# EAGLE design RS485_V3 (EAGLE 9.6.2)
CNAME: Vikings Robotics; DESIGNER: Ali ElShimy
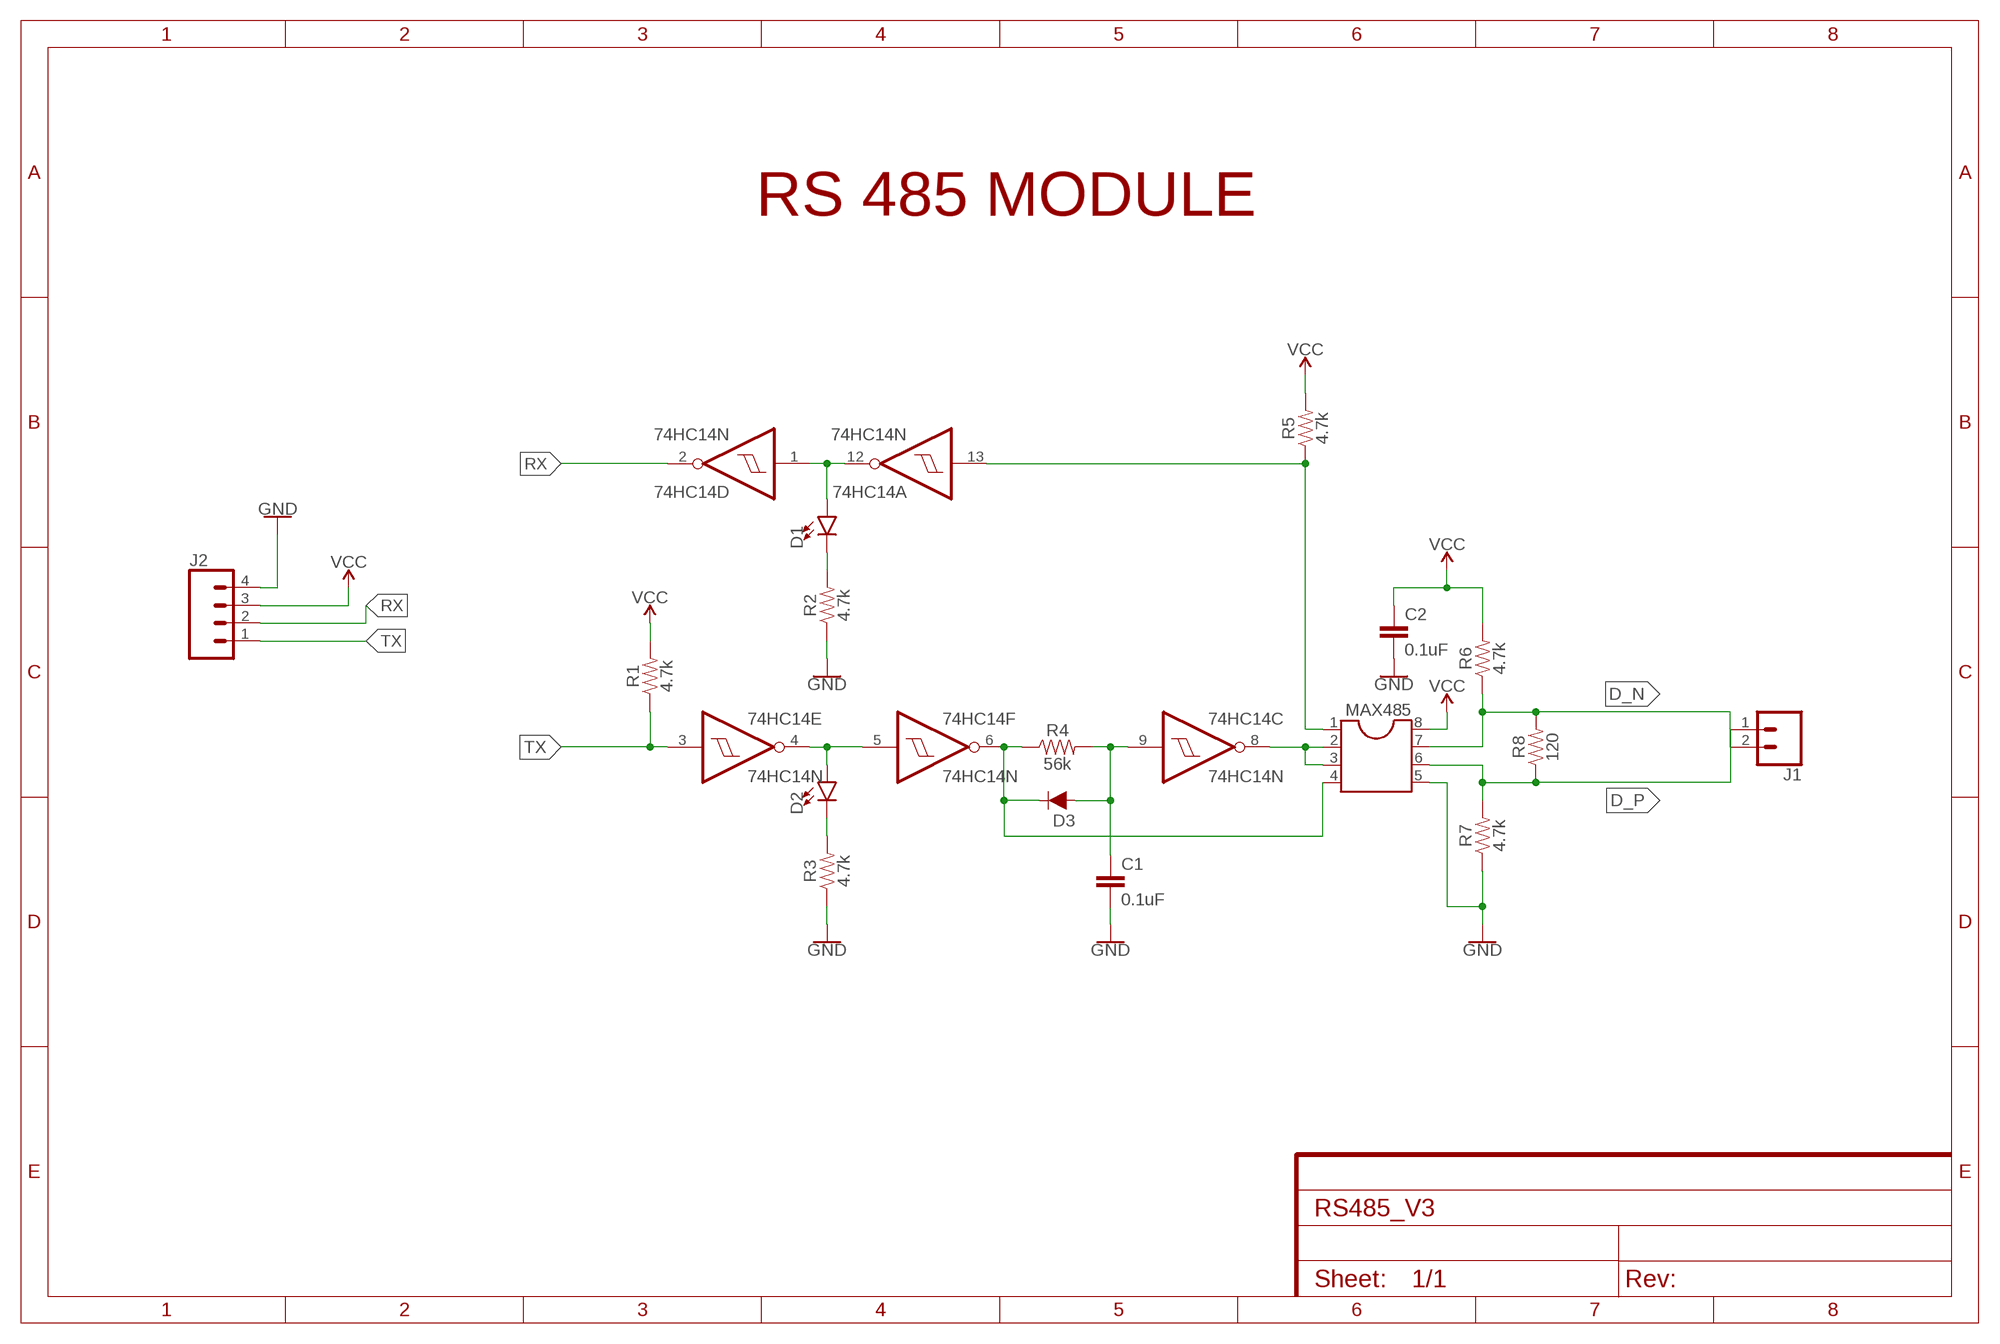
[diagram p0: schematic, sheet 1]

## Parts
74HC14  74HC14N  [DIL14]
C1  0.1uF  0.1UF-KIT-EZ-50V-20%  [CAP-PTH-SMALL-KIT]
C2  0.1uF  0.1UF-KIT-EZ-50V-20%  [CAP-PTH-SMALL-KIT]
D1  LED5MM-KIT  [LED_5MM-KIT]
D2  LED5MM-KIT  [LED_5MM-KIT]
D3  200mA/100V/1V  DIODE-1N4148  [DIODE-1N4148]
J1  CONN_02POLAR  [MOLEX-1X2]
J2  CONN_04POLAR  [MOLEX-1X4]
MAX485  DIL8  [DIL08]
R1  4.7k  10MOHM-HORIZ-1/4W-5%  [AXIAL-0.3]
R2  4.7k  10MOHM-HORIZ-1/4W-5%  [AXIAL-0.3]
R3  4.7k  10MOHM-HORIZ-1/4W-5%  [AXIAL-0.3]
R4  56k  10MOHM-HORIZ-1/4W-5%  [AXIAL-0.3]
R5  4.7k  10MOHM-HORIZ-1/4W-5%  [AXIAL-0.3]
R6  4.7k  10MOHM-HORIZ-1/4W-5%  [AXIAL-0.3]
R7  4.7k  10MOHM-HORIZ-1/4W-5%  [AXIAL-0.3]
R8  120  10MOHM-HORIZ-1/4W-5%  [AXIAL-0.3]

## Nets
D_N: J1.2 MAX485.7 R6.P$1 R8.P$2
D_P: J1.1 MAX485.6 R7.P$2 R8.P$1
GND: C1.2 C2.2 J2.4 MAX485.5 R2.P$1 R3.P$1 R7.P$1
N$1: 74HC14.1(D:I) 74HC14.12(A:O) D1.A
N$2: D1.K(C) R2.P$2
N$3: 74HC14.4(E:O) 74HC14.5(F:I) D2.A
N$4: D2.K(C) R3.P$2
N$6: 74HC14.9(C:I) C1.1 D3.A R4.P$2
N$7: 74HC14.6(F:O) D3.C MAX485.4 R4.P$1
N$8: 74HC14.8(C:O) MAX485.2 MAX485.3
N$9: 74HC14.13(A:I) MAX485.1 R5.P$1
RX: 74HC14.2(D:O) J2.2
TX: 74HC14.3(E:I) J2.1 R1.P$1
VCC: C2.1 J2.3 MAX485.8 R1.P$2 R5.P$2 R6.P$2
Unconnected: 74HC14.10(B:O) 74HC14.11(B:I)

## Notes on the sheet
- RS 485 MODULE

## Power pins joined to a net without a drawn wire
GND: 74HC14.7(P:GND)
VCC: 74HC14.14(P:VCC)

## Library data of the parts
74HC14 = 74xx-eu:74*14: Hex schmitt trigger INVERTER
C1 C2 = SparkFun-Capacitors:0.1UF: 0.1µF ceramic capacitors A capacitor is a passive two-terminal electrical component used to store electrical energy temporarily in an electric field.; PROD_ID: CAP-08370
D1 D2 = SparkFun-LED:LED: LED (Generic) Standard schematic elements and footprints for 5mm, 3mm, 1206, and 0603 sized LEDs. Generic LEDs with no color specified.
D3 = SparkFun-DiscreteSemi:DIODE: Diode These are standard reverse protection diodes and small signal diodes. SparkFun Products: SparkFun SparkPunk Sound Kit <https://www.sparkfun.com/products/11177> SparkFun ESP8266 Thing <https://www.sparkfun.com/products/13231>; PROD_ID: DIO-08378
J1 = SparkFun-Connectors:CONN_02: Multi connection point. Often used as Generic Header-pin footprint for 0.1 inch spaced/style header connections On any of the 0.1 inch spaced packages, you can populate with these: Break Away Headers - Straight <https://www.sparkfun.com/products/116> (PRT-00116) Break Away Male Headers - Right Angle <https://www.sparkfun.com/products/553> (PRT-00553) Female Headers <https://www.sparkfun.com/products/115> (PRT-00115) Break Away Headers - Machine Pin <https://www.sparkfun.com/products/117> (PRT-00117) Break Away Female Headers - Swiss Machine Pin <https://www.sparkfun.com/products/743> (PRT-00743) For SCREWTERMINALS and SPRING TERMINALS visit here: Screw Terimnals on SparkFun.com <https://www.sparkfun.com/search/results?term=Screw+Terminals> (5mm/3.5mm/2.54mm spacing) This device is also useful as a general connection point to wire up your design to another part of your project. Our various solder wires solder well into these plated through hole pads. Hook-Up Wire - Assortment (Stranded, 22 AWG) <https://www.sparkfun.com/products/11375> (PRT-11375) Hook-Up Wire - Assortment (Solid Core, 22 AWG) <https://www.sparkfun.com/products/11367> (PRT-11367) View the entire wire category on our website here <https://www.sparkfun.com/categories/141> Special notes: Molex polarized connector foot print use with: PRT-08233 with associated crimp pins and housings. 2.54_SCREWTERM for use with PRT-10571. 3.5mm Screw Terminal footprints for PRT-08084 5mm Screw Terminal footprints for use with PRT-08432; SF_ID: PRT-09918
J2 = SparkFun-Connectors:CONN_04: Multi connection point. Often used as Generic Header-pin footprint for 0.1 inch spaced/style header connections On any of the 0.1 inch spaced packages, you can populate with these: Break Away Headers - Straight <https://www.sparkfun.com/products/116> (PRT-00116) Break Away Male Headers - Right Angle <https://www.sparkfun.com/products/553> (PRT-00553) Female Headers <https://www.sparkfun.com/products/115> (PRT-00115) Break Away Headers - Machine Pin <https://www.sparkfun.com/products/117> (PRT-00117) Break Away Female Headers - Swiss Machine Pin <https://www.sparkfun.com/products/743> (PRT-00743) For SCREWTERMINALS and SPRING TERMINALS visit here: Screw Terimnals on SparkFun.com <https://www.sparkfun.com/search/results?term=Screw+Terminals> (5mm/3.5mm/2.54mm spacing) This device is also useful as a general connection point to wire up your design to another part of your project. Our various solder wires solder well into these plated through hole pads. Hook-Up Wire - Assortment (Stranded, 22 AWG) <https://www.sparkfun.com/products/11375> (PRT-11375) Hook-Up Wire - Assortment (Solid Core, 22 AWG) <https://www.sparkfun.com/products/11367> (PRT-11367) View the entire wire category on our website here <https://www.sparkfun.com/categories/141> Special notes: Molex polarized connector foot print use with SKU : PRT-08231 with associated crimp pins and housings. 1MM SMD Version SKU: PRT-10208; PROD_ID: CONN-08186; SF_ID: PRT-08231
MAX485 = ic-package:DIL8: Dual In Line / Socket
R1-R8 = SparkFun-Resistors:10MOHM: RES-09327; PROD_ID: RES-09327; VALUE: 10M

## Board
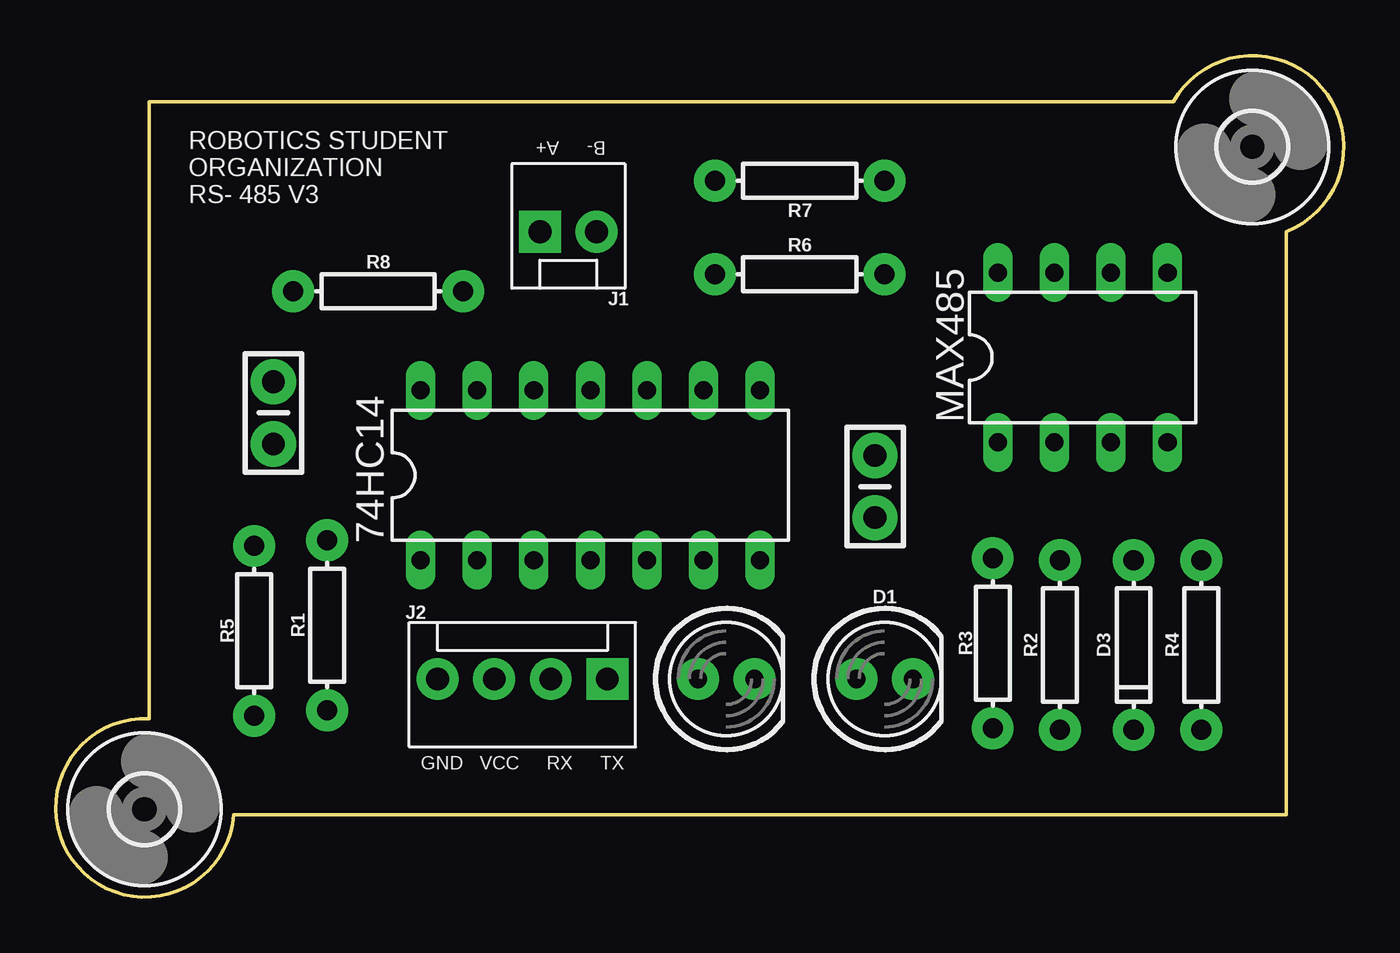
[diagram p1: board, top side]
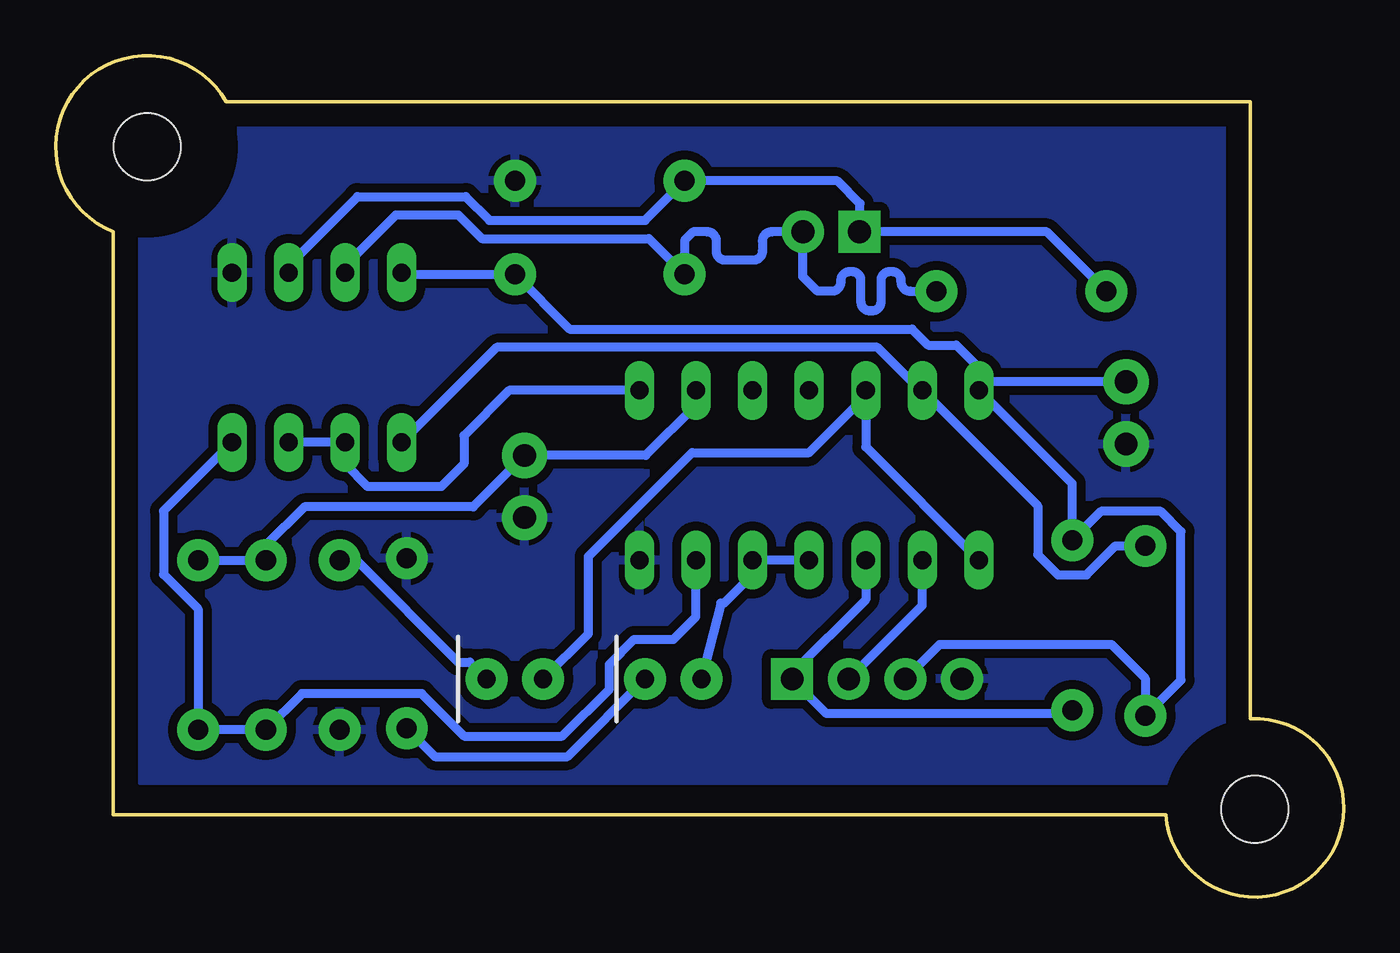
[diagram p2: board, bottom side, seen from below]

Size 57.82 x 37.75 mm. Coordinates in mm from the lower left corner, seen from the top.
Outline: 4.19,8.01 4.19,35.69 50.16,35.69 arc-218 55.24,29.85 55.24,3.69 8,3.69 arc-268 4.19,8.01
Copper layers (1*16): Top 0.035mm / dielectric 1.5mm / Bottom 0.035mm
Design rules "default *": minimum track width 6mil, minimum drill 0.35mm, track to track 16mil, track to pad 16mil, pad to pad 16mil, via to via 16mil, smd to smd 16mil, copper to edge 40mil, drill to drill 6mil, minimum pad ring 10mil, minimum via ring 8mil, stop-mask expansion 4mil, vias tented up to drill 0mil, thermal gap 10mil

### Footprints (pad centres in the part's own frame; a part is rotated, then mirrored left to right if it is on the bottom)
DIL14 = drill 0.813 long: 1 -7.62,-3.81; 2 -5.08,-3.81; 3 -2.54,-3.81; 4 0,-3.81; 5 2.54,-3.81; 6 5.08,-3.81; 7 7.62,-3.81; 8 7.62,3.81; 9 5.08,3.81; 10 2.54,3.81; 11 0,3.81; 12 -2.54,3.81; 13 -5.08,3.81; 14 -7.62,3.81
CAP-PTH-SMALL-KIT = drill 1.016 pad 2.032: 1 -1.397,0; 2 1.397,0
LED_5MM-KIT = drill 0.813 pad 1.88: A -1.27,0; K 1.27,0
DIODE-1N4148 = drill 0.9 pad 1.88: A -3.81,0; C 3.81,0
MOLEX-1X2 = drill 1.016 pad 1.88 square: 1 0,0 | drill 1.016 pad 1.88: 2 2.54,0
MOLEX-1X4 = drill 1.016 pad 1.88 square: 1 0,0 | drill 1.016 pad 1.88: 2 2.54,0; 3 5.08,0; 4 7.62,0
DIL08 = drill 0.813 long: 1 -3.81,-3.81; 2 -1.27,-3.81; 3 1.27,-3.81; 4 3.81,-3.81; 5 3.81,3.81; 6 1.27,3.81; 7 -1.27,3.81; 8 -3.81,3.81
AXIAL-0.3 = drill 0.9 pad 1.88: P$1 -3.81,0; P$2 3.81,0
3,0 = hole 3: 0,0

### Placement (x,y rotation side)
74HC14  24,18.93 0 top
C1  36.78,18.42 270 top
C2  9.78,21.72 270 top
D1  37.21,9.78 0 top
D2  30.1,9.78 0 top
D3  48.39,11.31 270 top
J1  21.74,29.85 0 top
J2  24.76,9.78 180 top
MAX485  46.1,24.21 0 top
R1  12.19,12.2 90 top
R2  45.08,11.31 90 top
R3  42.06,11.38 270 top
R4  51.43,11.31 90 top
R5  8.91,11.94 270 top
R6  33.4,27.94 0 top
R7  33.4,32.14 180 top
R8  14.48,27.18 0 top
U$1  [3,0]  53.72,33.66 0 top
U$2  [3,0]  3.99,3.94 0 top

### Tracks (layer width: path | path; a pad name or v marks a point on that pad's centre or on a via)
D_N
  Bottom 0.406: MAX485.7 44.83,28.33 42.54,30.61 39.75,30.61 38.68,29.54 31.19,29.54 R6.P$1 29.59,29.47 29.21,29.85 28.57,29.85 arc90 28.17,29.44 28.17,28.99 arc-90 27.76,28.58 26.5,28.58 arc-90 26.1,28.99 26.1,29.44 arc90 25.69,29.85 J1.2 24.28,27.84 23.62,27.18 22.99,27.18 arc-90 22.58,27.59 22.58,27.66 arc90 22.17,28.06 22.08,28.06 arc90 21.68,27.66 21.68,26.71 arc-90 21.27,26.3 21.18,26.3 arc-90 20.77,26.71 20.77,27.66 arc90 20.37,28.06 20.28,28.06 arc90 19.87,27.66 19.87,27.59 arc-90 19.46,27.18 R8.P$2
D_P
  Bottom 0.406: MAX485.6 47.37,28.33 44.27,31.42 39.41,31.42 38.35,30.36 31.37,30.36 R7.P$2 22.73,32.14 21.72,31.12 21.72,29.87 J1.1 13.33,29.85 R8.P$1
GND
  pour Bottom: 4.44,5.21 53.97,5.21 53.97,34.68 4.44,34.68
N$1
  Bottom 0.406: 74HC14.12 21.46,22.48 | 21.46,22.48 21.46,20.2 74HC14.1 | D1.A 33.91,11.82 33.91,15.29 29.25,19.94 24,19.94 21.46,22.48
N$2
  Bottom 0.406: D1.K 39.24,10.55 39.75,10.55 44.32,15.12 R2.P$2
N$3
  Bottom 0.406: 74HC14.4 74HC14.5 26.54,14.46 27.81,13.19 27.96,13.19 D2.A
N$4
  Bottom 0.406: D2.K 34.85,6.3 40.79,6.3 R3.P$2
N$6
  Bottom 0.406: R4.P$2 D3.A 48.39,15.78 46.65,17.51 39.08,17.51 C1.1 31.34,19.82 29.08,22.08 74HC14.9
N$7
  Bottom 0.406: MAX485.4 52.98,17.33 52.98,14.48 51.43,12.93 R4.P$1 D3.C 46.76,9.12 41.39,9.12 39.48,7.22 35.08,7.22 32.97,9.33 32.97,10.44 31.85,11.56 30.1,11.56 29.08,12.58 74HC14.6
N$8
  Bottom 0.406: 74HC14.8 37.46,22.74 39.5,20.71 39.5,19.44 40.51,18.42 43.81,18.42 44.83,19.44 MAX485.2 MAX485.3
N$9
  Bottom 0.406: R5.P$1 10.25,15.75 11.55,14.46 12.83,14.46 13.74,15.36 13.74,17.56 74HC14.13 19.01,22.74 20.94,24.67 38.02,24.67 MAX485.1
RX
  Bottom 0.406: J2.2 18.92,13.09 74HC14.2
TX
  Bottom 0.406: 74HC14.3 21.46,13.34 24.76,10.04 J2.1 23.21,8.23 12.34,8.23 R1.P$1
VCC
  Bottom 0.406: 74HC14.14 12.19,18.55 R1.P$2 10.9,17.3 8.22,17.3 7.31,16.39 7.31,9.73 R5.P$2 8.91,9.81 10.44,11.33 18.13,11.33 J2.3 | MAX485.8 42.21,27.94 R6.P$2 34.75,25.48 19.38,25.48 18.67,24.77 17.4,24.77 16.38,23.75 74HC14.14 | C2.1 16,23.12 74HC14.14

### Text on the board
tNames: B- A+ | ROBOTICS STUDENT / ORGANIZATION / RS- 485 V3 | GND VCC RX TX